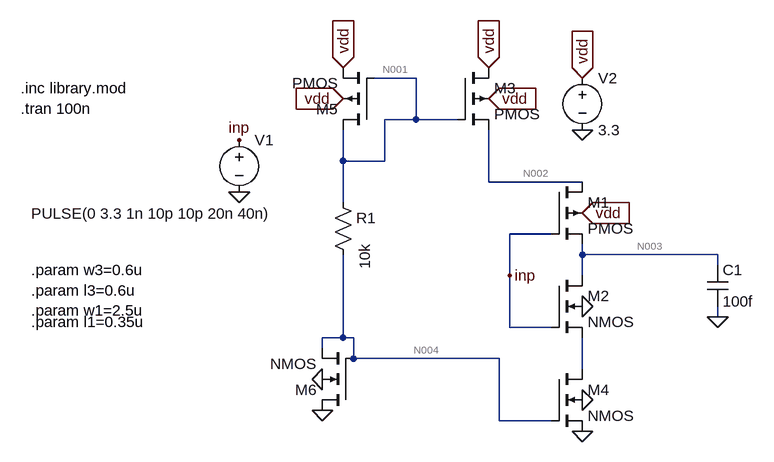
[diagram p0: schematic quiz10.asc]
quiz10.asc, the LTspice schematic file:
Version 4
SHEET 1 880 680
WIRE 240 32 176 32
WIRE 240 96 240 32
WIRE 240 96 192 96
WIRE 304 96 240 96
WIRE 128 160 128 112
WIRE 192 160 192 96
WIRE 192 160 128 160
WIRE 352 192 352 112
WIRE 496 192 352 192
WIRE 128 224 128 160
WIRE 448 272 384 272
WIRE 496 304 496 288
WIRE 704 304 496 304
WIRE 704 320 704 304
WIRE 384 336 384 272
WIRE 496 336 496 304
WIRE 704 400 704 384
WIRE 384 416 384 336
WIRE 448 416 384 416
WIRE 128 432 128 304
WIRE 128 432 96 432
WIRE 144 432 128 432
WIRE 96 448 96 432
WIRE 144 464 144 432
WIRE 368 464 144 464
WIRE 496 480 496 432
WIRE 368 560 368 464
WIRE 448 560 368 560
FLAG 496 32 vdd
IOPIN 496 32 In
FLAG 496 240 vdd
IOPIN 496 240 In
FLAG 128 64 vdd
IOPIN 128 64 In
FLAG 352 64 vdd
IOPIN 352 64 In
FLAG 496 384 0
FLAG 496 528 0
FLAG 96 496 0
FLAG 496 112 0
FLAG -32 208 0
FLAG 704 400 0
FLAG 96 544 0
FLAG 496 576 0
FLAG -32 128 inp
FLAG 352 16 vdd
IOPIN 352 16 In
FLAG 128 16 vdd
IOPIN 128 16 In
FLAG 384 336 inp
SYMBOL voltage -32 112 R0
WINDOW 3 -320 129 Left 2
WINDOW 123 0 0 Left 0
WINDOW 39 0 0 Left 0
SYMATTR InstName V1
SYMATTR Value PULSE(0 3.3 1n 10p 10p 20n 40n)
SYMBOL voltage 496 16 R0
WINDOW 123 0 0 Left 0
WINDOW 39 0 0 Left 0
SYMATTR InstName V2
SYMATTR Value 3.3
SYMBOL pmos4 448 192 R0
SYMATTR InstName M1
SYMATTR Value2 l=l1 w=w1
SYMBOL nmos4 448 336 R0
SYMATTR InstName M2
SYMATTR Value2 l=l1 w=w1
SYMBOL pmos4 304 16 R0
SYMATTR InstName M3
SYMATTR Value2 l=l3 w=w3
SYMBOL nmos4 448 480 R0
SYMATTR InstName M4
SYMATTR Value2 l=l3 w=w3
SYMBOL pmos4 176 112 R180
SYMATTR InstName M5
SYMATTR Value2 l=l3 w=w3
SYMBOL nmos4 144 544 R180
SYMATTR InstName M6
SYMATTR Value2 l=l3 w=w3
SYMBOL res 112 208 R0
WINDOW 3 49 119 VLeft 2
SYMATTR InstName R1
SYMATTR Value 10k
SYMBOL cap 688 320 R0
SYMATTR InstName C1
SYMATTR Value 100f
TEXT -368 48 Left 2 !.inc library.mod\n.tran 100n
TEXT -352 328 Left 2 !.param w3=0.6u\n.param l3=0.6u\n.param w1=2.5u
TEXT -352 408 Left 2 !.param l1=0.35u

The netlist it stands for:
* quiz10.asc
V1 inp 0 PULSE(0 3.3 1n 10p 10p 20n 40n)
V2 vdd 0 3.3
M1 N002 inp N003 vdd PMOS l=l1 w=w1
M2 N003 inp N005 0 NMOS l=l1 w=w1
M3 vdd N001 N002 vdd PMOS l=l3 w=w3
M4 N005 N004 0 0 NMOS l=l3 w=w3
M5 N001 N001 vdd vdd PMOS l=l3 w=w3
M6 0 N004 N004 0 NMOS l=l3 w=w3
R1 N001 N004 10k
C1 N003 0 100f
.model NMOS NMOS
.model PMOS PMOS
.lib standard.mos
.inc library.mod
.tran 100n
.param w3=0.6u
.param l3=0.6u
.param w1=2.5u
.param l1=0.35u
.backanno
.end

* Results of the author's LTspice run, read from the files saved beside the schematic
* Operating Point, zero values left out:
*   V(vdd) = 3.3 V
*   V(n002) = 3.3 V
*   V(n003) = 3.3 V
*   V(n001) = 1.376 V
*   V(n004) = 1.169 V
*   Id(M1) = 2.706 pA
*   Is(M1) = -2.706 pA
*   Id(M3) = -1.105 pA
*   Is(M3) = 1.105 pA
*   Id(M5) = -20.72 µA
*   Ib(M5) = 1.934 pA
*   Is(M5) = 20.72 µA
*   Id(M2) = 3.525 pA
*   Ib(M2) = -3.31 pA
*   Id(M6) = -20.72 µA
*   Ib(M6) = -1.179 pA
*   Is(M6) = 20.72 µA
*   I(R1) = 20.72 µA
*   I(V2) = -20.72 µA
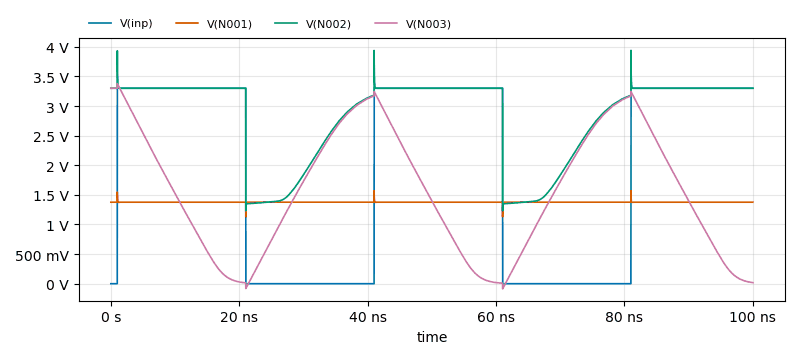
[diagram p1: Transient Analysis of quiz10.asc, plotted from the saved traces]
* Transient Analysis, 1 run:
*   V(inp): min 0 V, max 3.3 V, average 1.947 V, rms 2.535 V, last 3.3 V
*   V(N001): min 1.131 V, max 1.571 V, average 1.376 V, rms 1.376 V, last 1.376 V
*   V(N002): min 1.229 V, max 3.939 V, average 2.827 V, rms 2.917 V, last 3.3 V
*   V(N003): min -86.12 mV, max 3.378 V, average 1.559 V, rms 1.886 V, last 18.45 mV